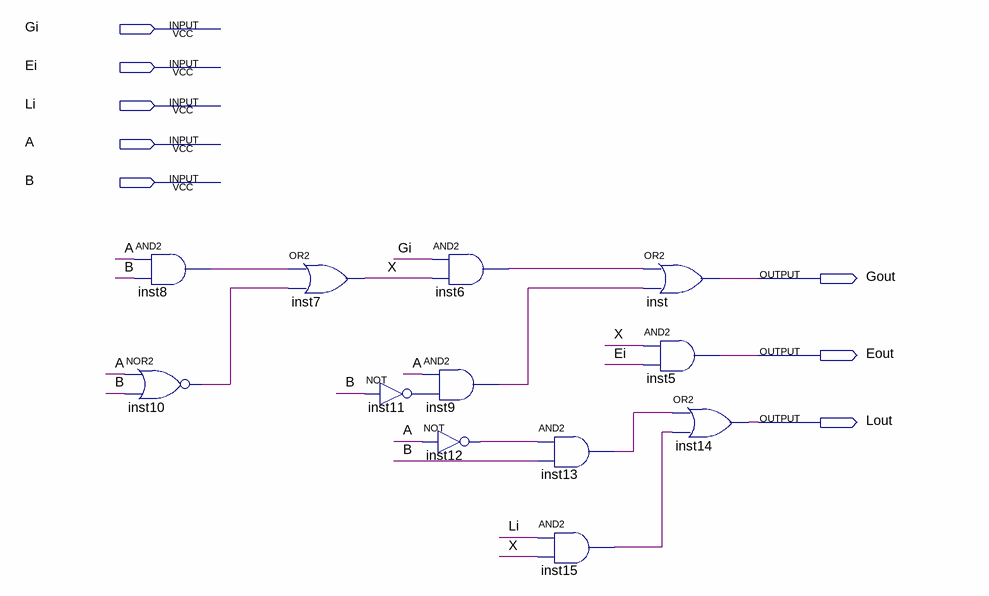
[diagram p0: schematic sheet]
// Quartus schematic CMP1.bdf as structural Verilog: 12 symbols, 8 pins
module CMP1 (
  input  Gi,
  input  Ei,
  input  Li,
  input  A,
  input  B,
  output Gout,
  output Eout,
  output Lout
);

  wire inst6_out, inst8_out, inst9_out, inst10_out, inst11_out, inst12_out, inst13_out, inst15_out, X;

  nor inst10 (inst10_out, A, B);
  and inst8 (inst8_out, A, B);
  or inst7 (X, inst8_out, inst10_out);
  and inst6 (inst6_out, Gi, X);
  and inst9 (inst9_out, A, inst11_out);
  not inst11 (inst11_out, B);
  not inst12 (inst12_out, A);
  and inst13 (inst13_out, inst12_out, B);
  and inst15 (inst15_out, Li, X);
  or inst (Gout, inst6_out, inst9_out);
  and inst5 (Eout, X, Ei);
  or inst14 (Lout, inst13_out, inst15_out);
endmodule
